# Altium schematic sheet 2015_AX12DUPLICATOR.SchDoc
size A4
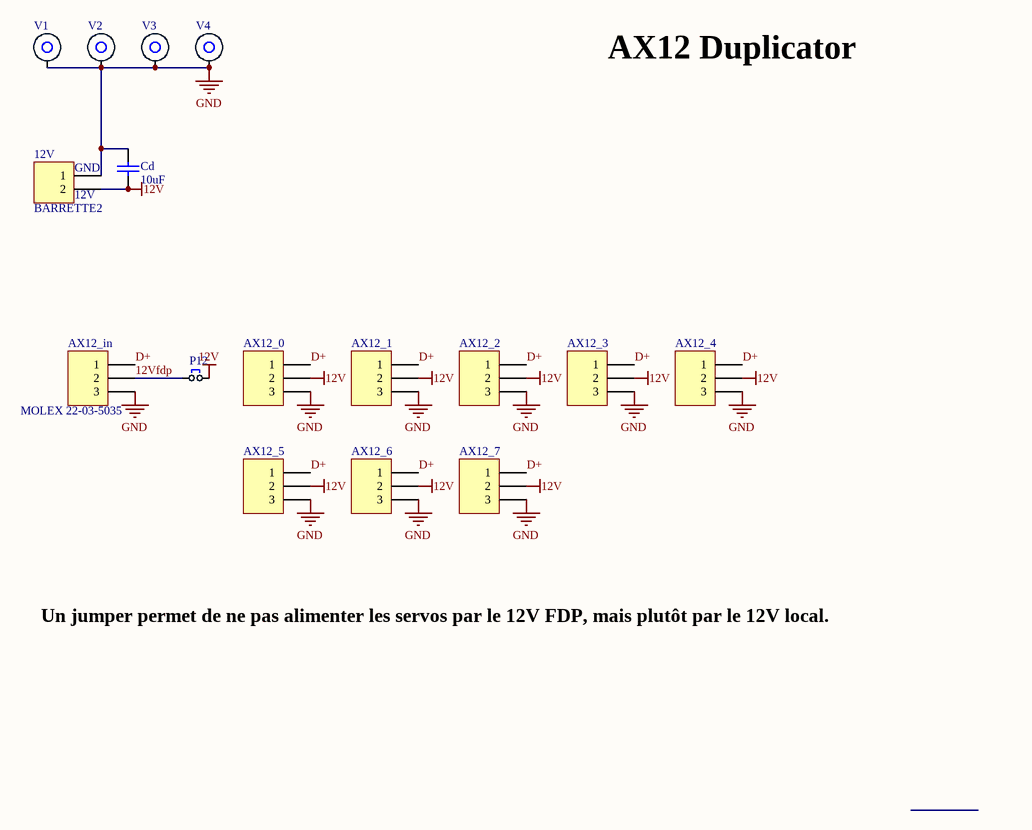
[diagram p0: 2015_AX12DUPLICATOR.SchDoc]

## Parts
12V  BARRETTE2  [BORNIER2_HORIZ]
AX12_0  MOLEX 22-03-5035  [MOLEX3_2.5MM]  (value not drawn)
AX12_1  MOLEX 22-03-5035  [MOLEX3_2.5MM]  (value not drawn)
AX12_2  MOLEX 22-03-5035  [MOLEX3_2.5MM]  (value not drawn)
AX12_3  MOLEX 22-03-5035  [MOLEX3_2.5MM]  (value not drawn)
AX12_4  MOLEX 22-03-5035  [MOLEX3_2.5MM]  (value not drawn)
AX12_5  MOLEX 22-03-5035  [MOLEX3_2.5MM]  (value not drawn)
AX12_6  MOLEX 22-03-5035  [MOLEX3_2.5MM]  (value not drawn)
AX12_7  MOLEX 22-03-5035  [MOLEX3_2.5MM]  (value not drawn)
AX12_in  MOLEX 22-03-5035  [MOLEX3_2.5MM]
Cd  10uF  [C1206_N]
P12  Jumper SIP 2.54  [HDR1X2]  (value not drawn)
V1  Entretoise WURTH CMS  [ENTRETOISE_CMS]  (value not drawn)
V2  Entretoise WURTH CMS  [ENTRETOISE_CMS]  (value not drawn)
V3  Entretoise WURTH CMS  [ENTRETOISE_CMS]  (value not drawn)
V4  Entretoise WURTH CMS  [ENTRETOISE_CMS]  (value not drawn)

## Nets
12V: 12V.2 AX12_0.2 AX12_1.2 AX12_2.2 AX12_3.2 AX12_4.2 AX12_5.2 AX12_6.2 AX12_7.2 Cd.1 P12.2
GND: 12V.1 AX12_0.3 AX12_1.3 AX12_2.3 AX12_3.3 AX12_4.3 AX12_5.3 AX12_6.3 AX12_7.3 AX12_in.3 Cd.2 V1.1 V2.1 V3.1 V4.1
12Vfdp: AX12_in.2 P12.1
D+: AX12_0.1 AX12_1.1 AX12_2.1 AX12_3.1 AX12_4.1 AX12_5.1 AX12_6.1 AX12_7.1 AX12_in.1

## Notes on the sheet
- AX12 Duplicator
- (near 12V) GND
- (near 12V) 12V
- Un jumper permet de ne pas alimenter les servos par le 12V FDP, mais plutôt par le 12V local.
- Title
- Size:
- Date:
- A4
- Number:
- Time:
- Revision:
- Sheet
- of
- File:

## Library data of the parts
12V = BARRETTE2: Header, 2-Pin; LatestRevisionDate: 17-Jul-2002; LatestRevisionNote: Re-released for DXP Platform.; Publisher: Altium Limited
AX12_0-AX12_7 AX12_in = BARRETTE3: Header, 3-Pin; LatestRevisionDate: 17-Jul-2002; LatestRevisionNote: Re-released for DXP Platform.; Publisher: Altium Limited
Cd = Condensateur: Capacitor; Published: 8-Jun-2000; LatestRevisionDate: 17-Jul-2002; LatestRevisionNote: Re-released for DXP Platform.; PackageReference: RAD-0.3; Publisher: Altium Limited
P12 = Jumper SIP2.54
V1-V4 = Entretoise WURTH CMS: Entretoise Wurth; Publisher: Damien Guitton